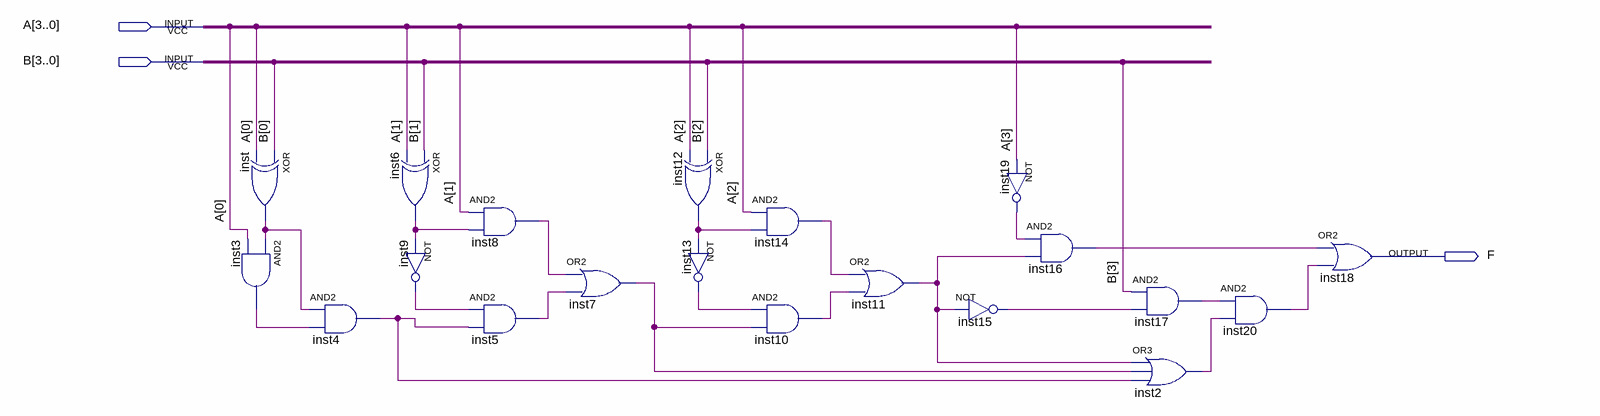
[diagram p0: schematic sheet]
// Quartus schematic MaiorQue.bdf as structural Verilog: 20 symbols, 3 pins
module MaiorQue (
  input  [3:0] A,
  input  [3:0] B,
  output F
);

  wire inst2_out, inst3_out, inst4_out, inst5_out, inst6_out, inst7_out, inst8_out, inst9_out, inst10_out,
       inst11_out, inst12_out, inst13_out, inst14_out, inst15_out, inst16_out, inst17_out, inst19_out,
       inst20_out, inst_out;

  xor inst (inst_out, B[0], A[0]);
  and inst3 (inst3_out, inst_out, A[0]);
  and inst4 (inst4_out, inst_out, inst3_out);
  xor inst6 (inst6_out, B[1], A[1]);
  not inst9 (inst9_out, inst6_out);
  and inst8 (inst8_out, A[1], inst6_out);
  and inst5 (inst5_out, inst9_out, inst4_out);
  or inst7 (inst7_out, inst8_out, inst5_out);
  xor inst12 (inst12_out, B[2], A[2]);
  not inst13 (inst13_out, inst12_out);
  and inst14 (inst14_out, A[2], inst12_out);
  and inst10 (inst10_out, inst13_out, inst7_out);
  or inst11 (inst11_out, inst14_out, inst10_out);
  not inst15 (inst15_out, inst11_out);
  not inst19 (inst19_out, A[3]);
  and inst16 (inst16_out, inst19_out, inst11_out);
  and inst17 (inst17_out, B[3], inst15_out);
  or inst2 (inst2_out, inst11_out, inst7_out, inst4_out);
  and inst20 (inst20_out, inst17_out, inst2_out);
  or inst18 (F, inst16_out, inst20_out);
endmodule
